# Altium schematic sheet drivers.SchDoc
size A
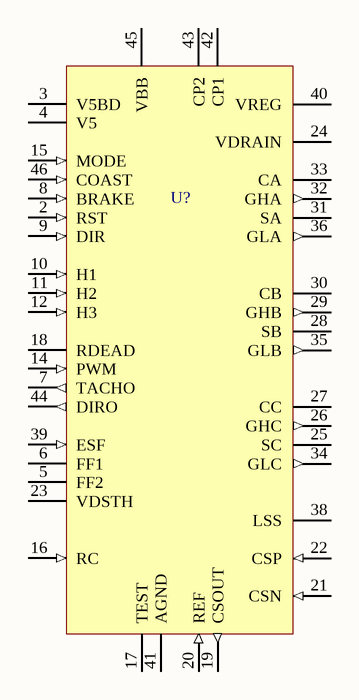
[diagram p0: drivers.SchDoc]

## Parts
U?  (no value)  [TQFP48_M]

## Nets

Not connected (* = marked no-connect by the designer): U? 2(RST) 3(V5BD) 4(V5) 5(FF2) 6(FF1) 7(TACHO) 8(BRAKE) 9(DIR) 10(H1) 11(H2) 12(H3) 14(PWM) 15(MODE) 16(RC) 17(TEST) 18(RDEAD) 19(CSOUT) 20(REF) 21(CSN) 22(CSP) 23(VDSTH) 24(VDRAIN) 25(SC) 26(GHC) 27(CC) 28(SB) 29(GHB) 30(CB) 31(SA) 32(GHA) 33(CA) 34(GLC) 35(GLB) 36(GLA) 38(LSS) 39(ESF) 40(VREG) 41(AGND) 42(CP1) 43(CP2) 44(DIRO) 45(VBB) 46(COAST) 47(AGND)

## Library data of the parts
U? = A3930: brushless motor driver, 3-phase